# EAGLE design hall_sensor_final_displayv5 (EAGLE 7.5.0)
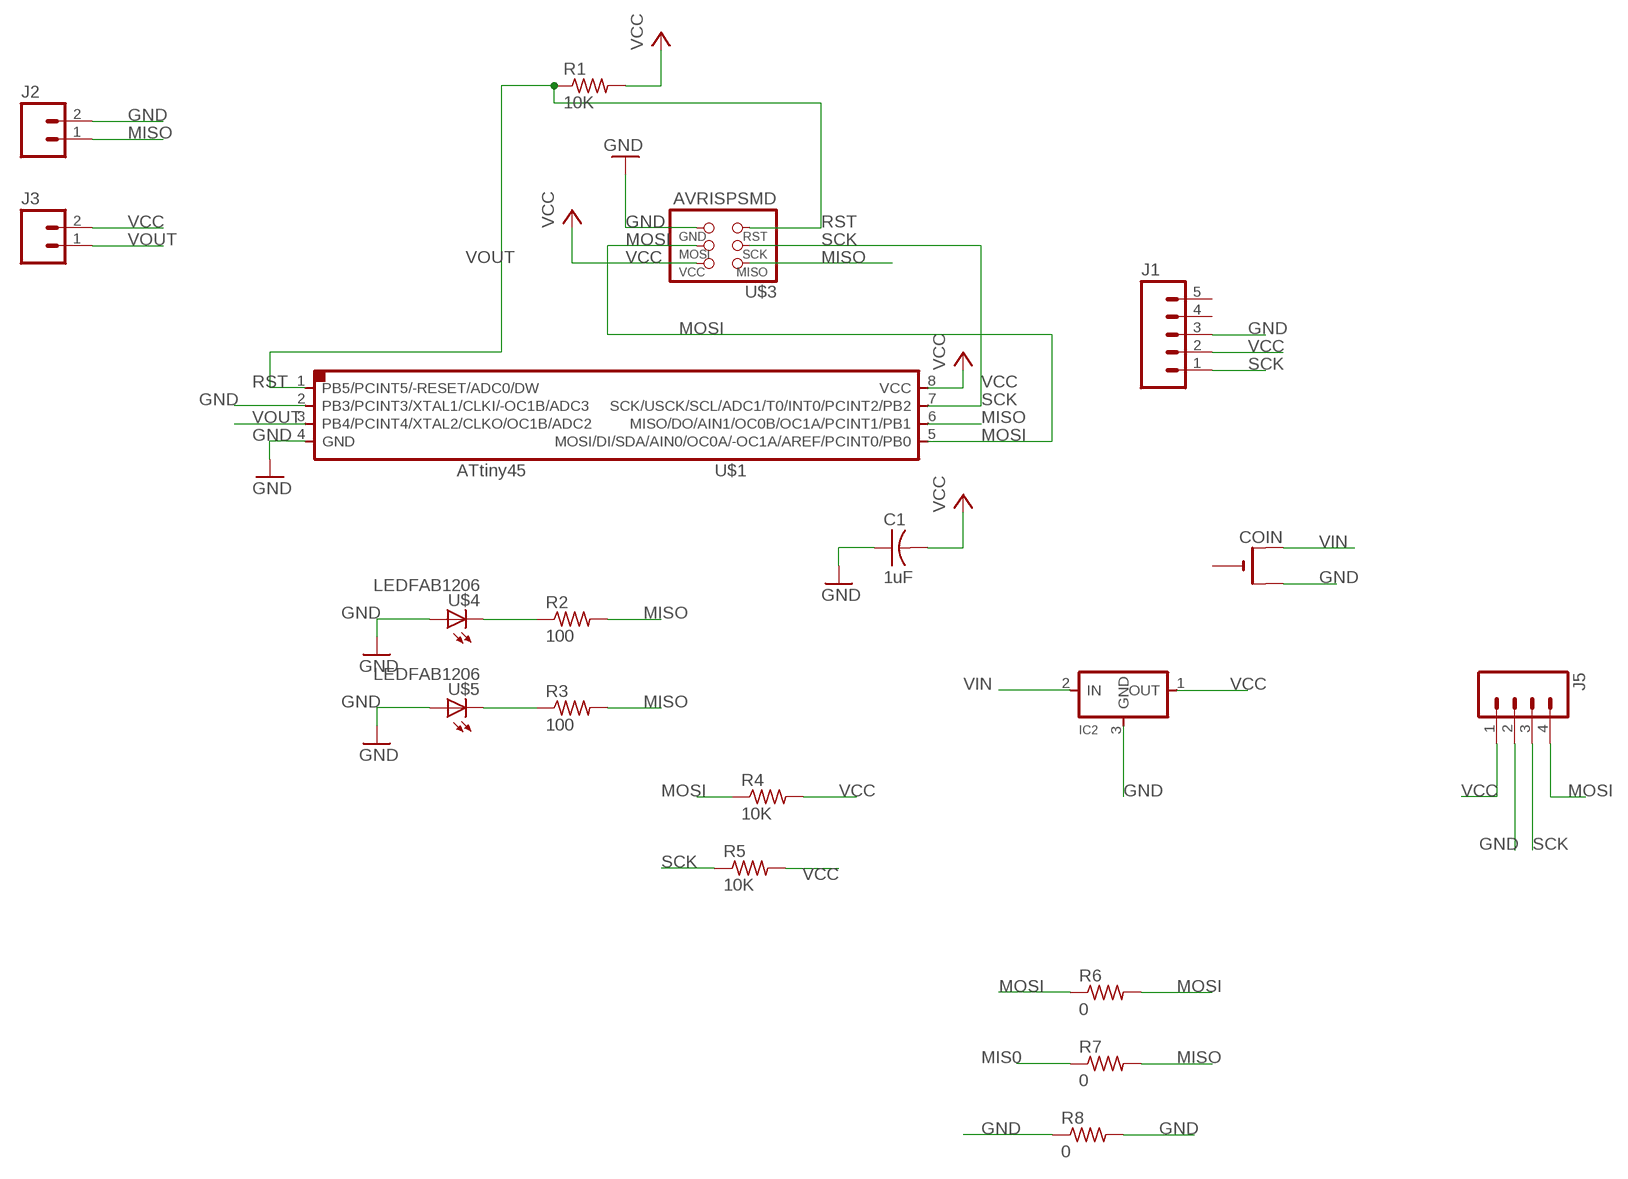
[diagram p0: schematic, sheet 1]

## Parts
C1  1uF  CAP-US1206FAB  [C1206FAB]
COIN  CR2032THM  [CR2032-THRU]
IC2  REGULATORSOT23  [SOT23]
J1  M05LOCK  [1X05_LOCK]
J2  M02POLAR_LOCK  [MOLEX-1X2_LOCK]
J3  M02POLAR_LOCK  [MOLEX-1X2_LOCK]
J5  M04LOCK  [1X04_LOCK]
R1  10K  RES-US1206FAB  [R1206FAB]
R2  100  RES-US1206FAB  [R1206FAB]
R3  100  RES-US1206FAB  [R1206FAB]
R4  10K  RES-US1206FAB  [R1206FAB]
R5  10K  RES-US1206FAB  [R1206FAB]
R6  0  RES-US1206FAB  [R1206FAB]
R7  0  RES-US1206FAB  [R1206FAB]
R8  0  RES-US1206FAB  [R1206FAB]
U$1  ATTINY45SI  [SOIC8]
U$3  AVRISPSMD  [2X03SMD]
U$4  LEDFAB1206  [LED1206FAB]
U$5  LEDFAB1206  [LED1206FAB]

## Nets
GND: C1.1 COIN.+2(+1) IC2.3(GND) J1.3 J2.2 J5.2 R8.1 R8.2 U$1.2(PB3/PCINT3/XTAL1/CLKI/-OC1B/ADC3) U$1.4(GND) U$3.6(GND) U$4.1(A) U$5.1(A)
MIS0: R7.1
MISO: J2.1 R2.2 R3.2 R7.2 U$1.6(MISO/DO/AIN1/OC0B/OC1A/PCINT1/PB1) U$3.1(MISO)
MOSI: J5.4 R4.1 R6.1 R6.2 U$1.5(MOSI/DI/SDA/AIN0/OC0A/-OC1A/AREF/PCINT0/PB0) U$3.4(MOSI)
N$1: R2.1 U$4.2(C)
N$2: R3.1 U$5.2(C)
RST: R1.1 U$1.1(PB5/PCINT5/-RESET/ADC0/DW) U$3.5(RST)
SCK: J1.1 J5.3 R5.1 U$1.7(SCK/USCK/SCL/ADC1/T0/INT0/PCINT2/PB2) U$3.3(SCK)
VCC: C1.2 IC2.1(OUT) J1.2 J3.2 J5.1 R1.2 R4.2 R5.2 U$1.8(VCC) U$3.2(VCC)
VIN: COIN.+1(+) IC2.2(IN)
VOUT: J3.1 U$1.3(PB4/PCINT4/XTAL2/CLKO/OC1B/ADC2)
Unconnected: COIN.- J1.4 J1.5

## Library data of the parts
C1 = fab (1):CAP-US
COIN = adafruit:CR2032
IC2 = fab:REGULATOR
J1 = SparkFun-Connectors:M05: Header 5 Standard 5-pin 0.1" header. Use with straight break away headers (SKU : PRT-00116), right angle break away headers (PRT-00553), swiss pins (PRT-00743), machine pins (PRT-00117), and female headers (PRT-00115). Molex polarized connector foot print use with SKU : PRT-08230 with associated crimp pins and housings.
J2 J3 = SparkFun-Connectors:M02: Standard 2-pin 0.1" header. Use with - straight break away headers ( PRT-00116) - right angle break away headers (PRT-00553) - swiss pins (PRT-00743) - machine pins (PRT-00117) - female headers (PRT-00115) Molex polarized connector foot print use with: PRT-08233 with associated crimp pins and housings. 2.54_SCREWTERM for use with PRT-10571. 3.5mm Screw Terminal footprints for PRT-08084 5mm Screw Terminal footprints for use with PRT-08432
J5 = SparkFun-Connectors:M04: Header 4 Standard 4-pin 0.1" header. Use with straight break away headers (SKU : PRT-00116), right angle break away headers (PRT-00553), swiss pins (PRT-00743), machine pins (PRT-00117), and female headers (PRT-00115). Molex polarized connector foot print use with SKU : PRT-08231 with associated crimp pins and housings. 1MM SMD Version SKU: PRT-10208; PROD_ID: CONN-09696
R1-R8 = fab (1):RES-US: Resistor (US Symbol) Variants with postfix FAB are widened to allow the routing of internal traces
U$1 = fab (1):ATTINY45
U$3 = fab (1):AVRISP
U$4 U$5 = fab (1):LED: LED

## Board
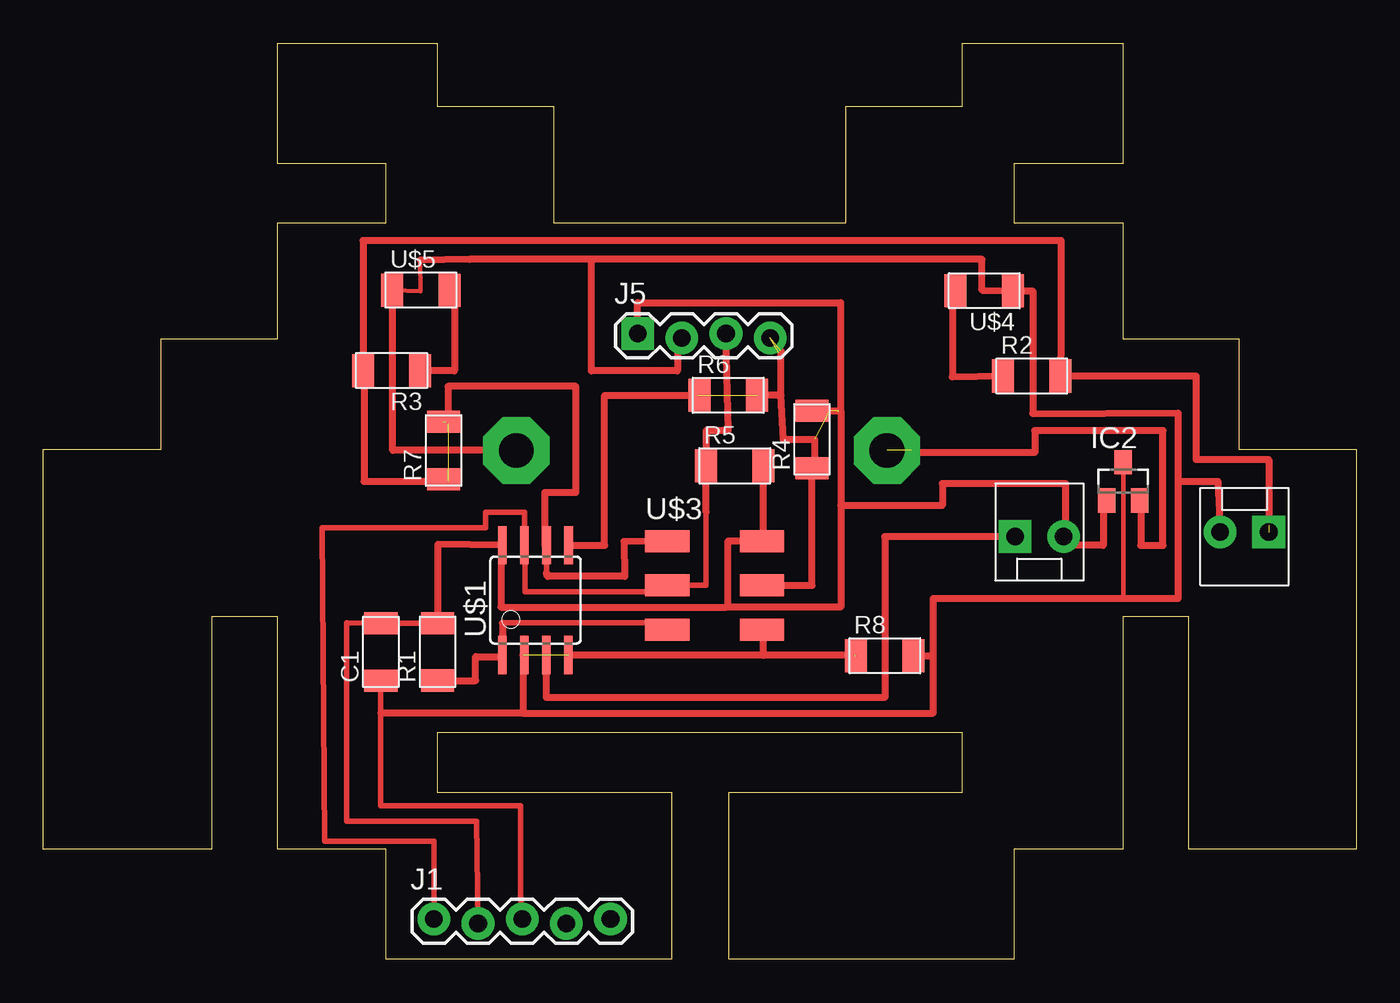
[diagram p1: board, top side]
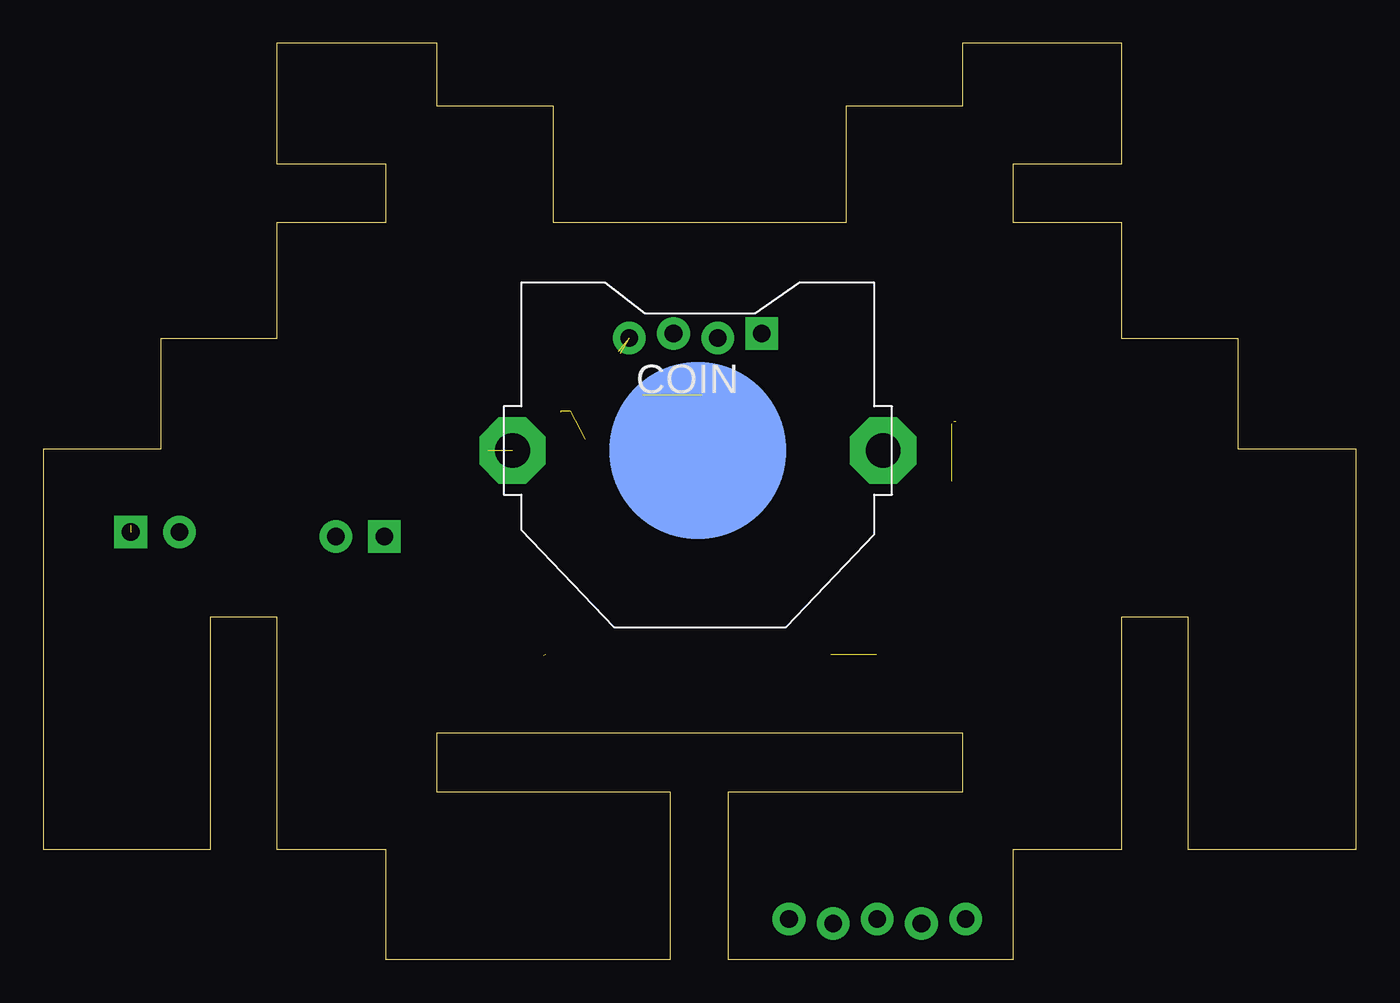
[diagram p2: board, bottom side, seen from below]

Size 75.55 x 52.69 mm. Coordinates in mm from the lower left corner, seen from the top.
Outline: 19.74,6.32 13.49,6.32 13.49,19.7 9.68,19.7 9.68,6.32 0,6.32 0,29.34 6.78,29.34 6.78,35.7 13.49,35.7 13.49,42.37 19.74,42.37 19.74,45.76 13.49,45.76 13.49,52.69 22.67,52.69 22.67,49.07 29.38,49.07 29.38,42.37 46.18,42.37 46.18,49.07 52.88,49.07 52.88,52.69 62.14,52.69 62.14,45.76 55.85,45.76 55.85,42.37 62.14,42.37 62.14,35.7 68.81,35.7 68.81,29.34 75.55,29.34 75.55,6.32 65.91,6.32 65.91,19.7 62.14,19.7 62.14,6.32 55.85,6.32 55.85,0 39.47,0 39.47,9.6 52.88,9.6 52.88,13.03 22.67,13.03 22.67,9.6 36.16,9.6 36.16,0 19.74,0 19.74,6.32
Copper layers (1*16): Top 0.035mm / dielectric 1.5mm / Bottom 0.035mm
Design rules "default *": minimum track width 10mil, minimum drill 24mil, track to track 16mil, track to pad 16mil, pad to pad 16mil, via to via 16mil, smd to smd 16mil, copper to edge 40mil, drill to drill 8mil, minimum pad ring 10mil, minimum via ring 8mil, stop-mask expansion 4mil, vias tented up to drill 0mil, thermal gap 10mil

### Footprints (pad centres in the part's own frame; a part is rotated, then mirrored left to right if it is on the bottom)
C1206FAB = smd 1.27 x 1.905: 1 -1.651,0; 2 1.651,0
CR2032-THRU = drill 2 pad 3.81 octagon: +1 -10.668,0; +2 10.668,0 | smd 10.16 x 10.16: - 0,0
SOT23 = smd 1 x 1.4: 1 -0.95,-1.1; 2 0.95,-1.1; 3 0,1.1
1X05_LOCK = drill 1.016 pad 1.88: 1 0,0.127; 2 2.54,-0.127; 3 5.08,0.127; 4 7.62,-0.127; 5 10.16,0.127
MOLEX-1X2_LOCK = drill 1.016 pad 1.88 square: 1 -0.127,0 | drill 1.016 pad 1.88: 2 2.667,0
1X04_LOCK = drill 1.016 pad 1.88 square: 1 0,0.127 | drill 1.016 pad 1.88: 2 2.54,-0.127; 3 5.08,0.127; 4 7.62,-0.127
R1206FAB = smd 1.27 x 1.905: 1 -1.651,0; 2 1.651,0
SOIC8 = smd 0.5 x 2.2: 1 -1.905,-3.154; 2 -0.645,-3.154; 3 0.625,-3.154; 4 1.895,-3.154; 5 1.905,3.154; 6 0.635,3.154; 7 -0.635,3.154; 8 -1.905,3.154
2X03SMD = smd 2.54 x 1.27: 1 -2.54,2.54; 2 2.92,2.54; 3 -2.54,0; 4 2.92,0; 5 -2.54,-2.54; 6 2.92,-2.54
LED1206FAB = smd 1.27 x 1.905: 1 -1.651,0; 2 1.651,0

### Placement (x,y rotation side)
C1  19.42,17.68 90 top
COIN  37.89,29.28 0 bottom
IC2  62.15,27.5 0 top
J1  22.48,2.18 0 top
J2  70.4,24.58 180 top
J3  56.05,24.32 0 top
J5  34.21,35.88 0 top
R1  22.69,17.69 90 top
R2  56.88,33.56 0 top
R3  20.04,33.87 180 top
R4  44.24,29.91 90 top
R5  39.79,28.39 0 top
R6  39.41,32.45 0 top
R7  23.03,29.28 90 top
R8  48.43,17.46 0 top
U$1  28.32,20.66 0 top
U$3  38.44,21.51 0 top
U$4  54.15,38.46 180 top
U$5  21.72,38.5 0 top

### Tracks (layer width: path | path; a pad name or v marks a point on that pad's centre or on a via)
GND  (3 unrouted)
  Top 0.254: 21.68,40.22 21.71,38.44 U$5.1 | IC2.3 62.15,20.77
  Top 0.305: C1.1 19.42,14.16 19.42,8.83 27.47,8.83 27.47,3.58 J1.3 | 20.11,38.8 U$5.1
  Top 0.406: 41.44,18.61 41.57,18.76 U$3.6 41.44,18.97 41.44,17.46 41.49,17.51 U$1.4 46.65,17.51 46.65,17.59 | 27.6,17.51 27.6,14.16 | 27.6,14.16 51.22,14.16 51.22,17.46 | 51.22,17.46 51.22,20.77 62.15,20.77 65.32,20.77 65.32,27.5 | 65.32,27.5 65.32,31.43 56.94,31.39 56.94,38.46 U$4.1 54.02,38.5 54.02,40.27 31.54,40.27 | 27.6,14.16 19.42,14.16 | COIN.+2 20.11,29.28 20.11,38.8 | 21.68,40.22 24.53,40.27 31.54,40.27 | J5.2 36.49,35.24 36.49,33.85 31.54,33.85 31.54,40.27 | 65.32,27.5 67.61,27.5 J2.2 | R8.2 51.22,17.46
MISO  (3 unrouted)
  Top 0.305: 28.97,22.23 28.95,22.23 U$1.6
  Top 0.406: U$3.1 33.41,24.03 33.45,22.03 29.03,22.03 28.97,22.23 28.96,22.23 | U$1.6 28.87,23.82 28.87,26.86 30.65,26.86 30.65,32.96 23.28,32.96 23.28,30.93 | 23.28,30.93 23.28,30.8 23.16,30.8 23.16,30.93 23.28,30.93 | 23.28,27.5 18.46,27.5 18.46,33.23 R3.2 18.39,41.34 58.59,41.34 58.59,35.08 R2.2 66.34,33.56 66.34,28.77 70.53,28.77 70.53,25.08 | 70.53,24.96 70.53,25.08 | 70.53,25.08 71.04,24.96
MOSI  (7 unrouted)
  Top 0.406: 44.62,28.64 44.38,28.4 | 44.38,28.4 R4.1 44.24,21.51 U$3.4 | U$1.5 32.3,23.82 32.3,32.45 37.63,32.45 37.63,32.7 | 44.38,28.4 44.38,29.91 42.59,29.91 42.46,32.45 | 42.46,32.45 R6.2 | 42.46,32.45 42.46,34.99
N$1
  Top 0.406: R2.1 52.31,33.51 52.31,38.46 U$4.2
N$2
  Top 0.406: U$5.2 23.66,38.63 23.66,33.85 21.69,33.85 R3.1
RST
  Top 0.305: U$3.5 arc90 35.52,19.35 26.42,19.35
  Top 0.406: R1.1 24.89,16.04 24.89,17.41 26.42,17.41 U$1.1 26.42,19.35
SCK
  Top 0.254: 27.73,23.23 27.63,23.23 27.63,23.56 U$1.7 | 35.54,21.15 35.55,21.25 35.88,21.25 U$3.3
  Top 0.305: 35.54,21.15 27.73,21.15 27.73,23.23 27.73,23.31 | J1.1 22.48,6.8 16.17,6.8 16.04,24.83 25.44,24.83 25.44,25.72 27.68,25.72 U$1.7 | U$3.3 38.14,21.51 38.14,25.72
  Top 0.406: J5.3 39.29,34.74 39.41,30.42 38.14,30.42 R5.1 38.14,25.72
VCC
  Top 0.305: J1.2 24.93,7.94 17.44,7.94 17.44,19.37 C1.2 R1.2
  Top 0.406: 18.71,19.33 C1.2 | R1.2 22.69,23.87 U$1.8 26.33,23.82 26.33,20.26 39.29,20.26 | IC2.1 61,26.4 61,23.81 58.72,23.81 J3.2 58.84,24.32 58.84,27.37 51.73,27.37 51.73,26.1 45.89,26.1 | 39.29,20.26 39.41,20.39 39.41,24.07 41.36,24.07 | 41.36,24.07 U$3.2 | 41.36,24.07 41.44,24.07 R5.2 41.44,28.89 | 45.89,26.1 45.89,20.26 39.29,20.26 | J5.1 34.21,37.78 45.89,37.78 45.89,31.56 | 45.89,31.56 45.89,26.1 | R4.2 45.89,31.56
VIN  (1 unrouted)
  Top 0.406: IC2.2 63.16,26.4 63.16,23.81 64.43,23.81 64.43,30.42 57.07,30.42 57.07,29.15 49.83,29.15 49.83,29.4 49.95,29.4 49.95,29.28
VOUT
  Top 0.406: J3.1 48.43,24.32 48.43,15.05 28.94,15.05 U$1.3